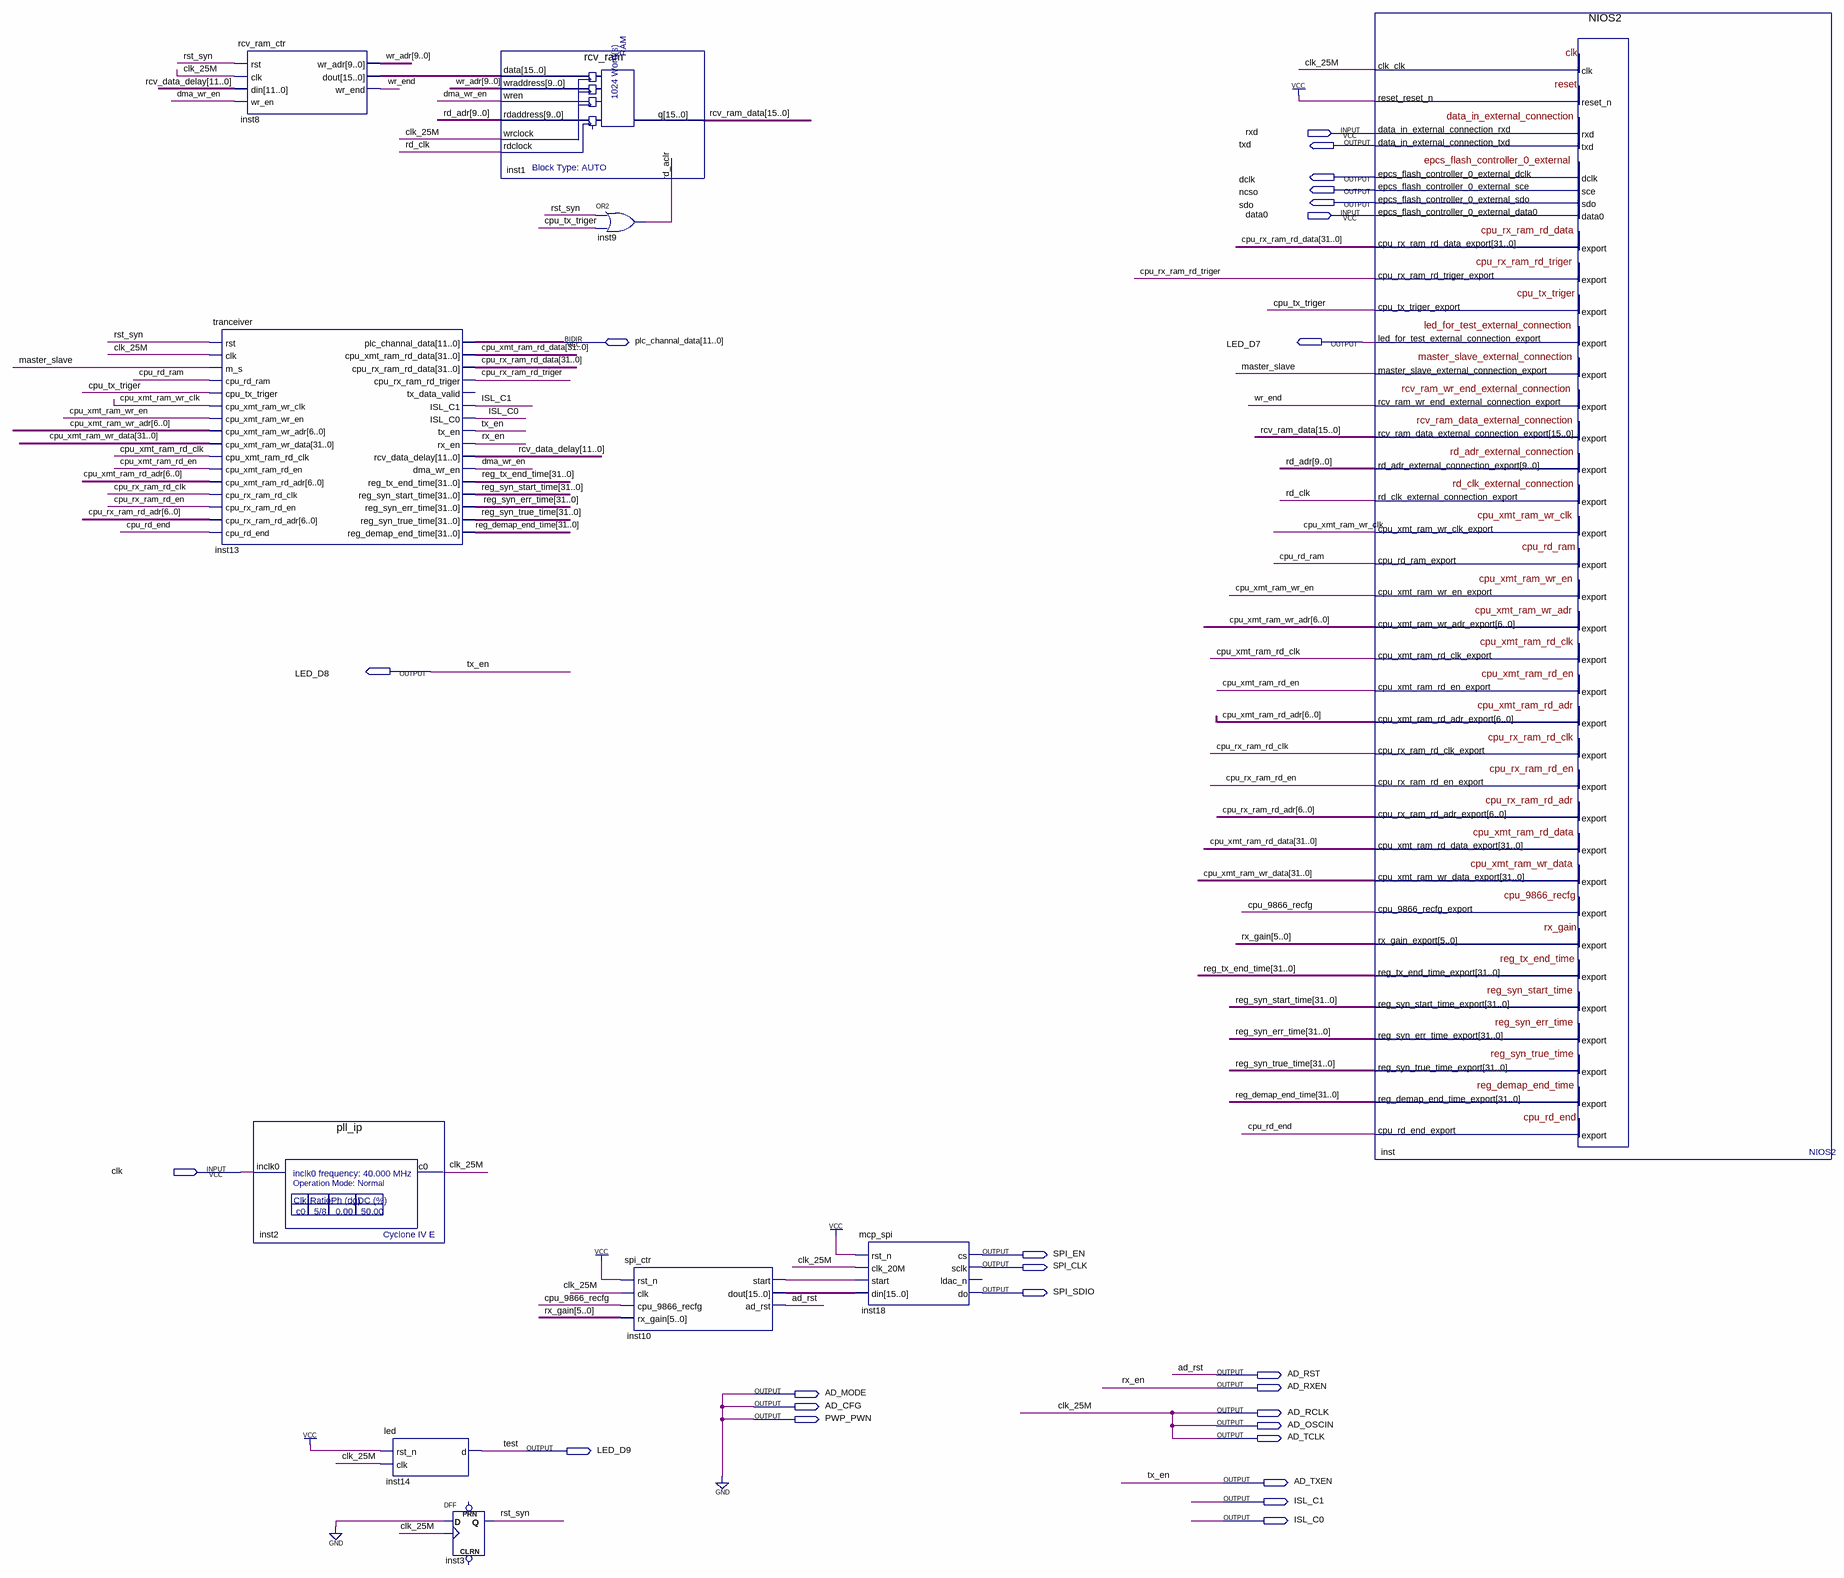
[diagram p0: schematic sheet]
// Quartus schematic plc_design_nios2.bdf as structural Verilog: 10 symbols, 25 pins
module plc_design_nios2 (
  input  rxd,
  input  data0,
  input  clk,
  inout  [11:0] plc_channal_data,
  output txd,
  output dclk,
  output ncso,
  output sdo,
  output LED_D7,
  output LED_D8,
  output SPI_EN,
  output SPI_CLK,
  output SPI_SDIO,
  output AD_RST,
  output AD_RXEN,
  output AD_MODE,
  output AD_CFG,
  output AD_RCLK,
  output PWP_PWN,
  output AD_OSCIN,
  output AD_TCLK,
  output LED_D9,
  output AD_TXEN,
  output ISL_C1,
  output ISL_C0
);

  wire cpu_9866_recfg, cpu_rd_end, cpu_rd_ram, cpu_rx_ram_rd_clk, cpu_rx_ram_rd_en, cpu_rx_ram_rd_triger,
       cpu_tx_triger, cpu_xmt_ram_rd_clk, cpu_xmt_ram_rd_en, cpu_xmt_ram_wr_clk, cpu_xmt_ram_wr_en,
       dma_wr_en, inst9_out, inst10_start, master_slave, rd_clk, rst_syn, wr_end;
  wire [5:0] rx_gain;
  wire [6:0] cpu_rx_ram_rd_adr, cpu_xmt_ram_rd_adr, cpu_xmt_ram_wr_adr;
  wire [9:0] rd_adr, wr_adr;
  wire [11:0] rcv_data_delay;
  wire [15:0] inst8_dout, inst10_dout, rcv_ram_data;
  wire [31:0] cpu_rx_ram_rd_data, cpu_xmt_ram_rd_data, cpu_xmt_ram_wr_data, reg_demap_end_time,
       reg_syn_err_time, reg_syn_start_time, reg_syn_true_time, reg_tx_end_time;

  rcv_ram_ctr inst8 (
    .rst(rst_syn), .clk(AD_OSCIN), .din(rcv_data_delay), .wr_en(dma_wr_en), .wr_adr(wr_adr),
    .dout(inst8_dout), .wr_end(wr_end));
  tranceiver inst13 (
    .rst(rst_syn), .clk(AD_OSCIN), .m_s(master_slave), .cpu_rd_ram(cpu_rd_ram),
    .cpu_tx_triger(cpu_tx_triger), .cpu_xmt_ram_wr_clk(cpu_xmt_ram_wr_clk),
    .cpu_xmt_ram_wr_en(cpu_xmt_ram_wr_en), .cpu_xmt_ram_wr_adr(cpu_xmt_ram_wr_adr),
    .cpu_xmt_ram_wr_data(cpu_xmt_ram_wr_data), .cpu_xmt_ram_rd_clk(cpu_xmt_ram_rd_clk),
    .cpu_xmt_ram_rd_en(cpu_xmt_ram_rd_en), .cpu_xmt_ram_rd_adr(cpu_xmt_ram_rd_adr),
    .cpu_rx_ram_rd_clk(cpu_rx_ram_rd_clk), .cpu_rx_ram_rd_en(cpu_rx_ram_rd_en),
    .cpu_rx_ram_rd_adr(cpu_rx_ram_rd_adr), .cpu_rd_end(cpu_rd_end),
    .cpu_xmt_ram_rd_data(cpu_xmt_ram_rd_data), .cpu_rx_ram_rd_data(cpu_rx_ram_rd_data),
    .cpu_rx_ram_rd_triger(cpu_rx_ram_rd_triger), .ISL_C1(ISL_C1), .ISL_C0(ISL_C0), .tx_en(AD_TXEN),
    .rx_en(AD_RXEN), .rcv_data_delay(rcv_data_delay), .dma_wr_en(dma_wr_en),
    .reg_tx_end_time(reg_tx_end_time), .reg_syn_start_time(reg_syn_start_time),
    .reg_syn_err_time(reg_syn_err_time), .reg_syn_true_time(reg_syn_true_time),
    .reg_demap_end_time(reg_demap_end_time), .plc_channal_data(plc_channal_data));  // open: tx_data_valid
  pll_ip inst2 (.inclk0(clk), .c0(AD_OSCIN));
  led inst14 (.rst_n(1'b1), .clk(AD_OSCIN), .d(LED_D9));
  DFF inst3 (.CLK(AD_OSCIN), .D(1'b0), .Q(rst_syn));  // open: CLRN, PRN
  rcv_ram inst1 (
    .data(inst8_dout), .wraddress(wr_adr), .wren(dma_wr_en), .rdaddress(rd_adr), .wrclock(AD_OSCIN),
    .rdclock(rd_clk), .rd_aclr(inst9_out), .q(rcv_ram_data));
  or inst9 (inst9_out, rst_syn, cpu_tx_triger);
  spi_ctr inst10 (
    .rst_n(1'b1), .clk(AD_OSCIN), .cpu_9866_recfg(cpu_9866_recfg), .rx_gain(rx_gain), .start(inst10_start),
    .dout(inst10_dout), .ad_rst(AD_RST));
  mcp_spi inst18 (
    .rst_n(1'b1), .clk_20M(AD_OSCIN), .start(inst10_start), .din(inst10_dout), .cs(SPI_EN), .sclk(SPI_CLK),
    .\do (SPI_SDIO));  // open: ldac_n
  NIOS2 inst (
    .clk_clk(AD_OSCIN), .reset_reset_n(1'b1), .data_in_external_connection_rxd(rxd),
    .epcs_flash_controller_0_external_data0(data0), .cpu_rx_ram_rd_data_export(cpu_rx_ram_rd_data),
    .cpu_rx_ram_rd_triger_export(cpu_rx_ram_rd_triger), .rcv_ram_wr_end_external_connection_export(wr_end),
    .rcv_ram_data_external_connection_export(rcv_ram_data), .cpu_xmt_ram_rd_data_export(cpu_xmt_ram_rd_data),
    .reg_tx_end_time_export(reg_tx_end_time), .reg_syn_start_time_export(reg_syn_start_time),
    .reg_syn_err_time_export(reg_syn_err_time), .reg_syn_true_time_export(reg_syn_true_time),
    .reg_demap_end_time_export(reg_demap_end_time), .data_in_external_connection_txd(txd),
    .epcs_flash_controller_0_external_dclk(dclk), .epcs_flash_controller_0_external_sce(ncso),
    .epcs_flash_controller_0_external_sdo(sdo), .cpu_tx_triger_export(cpu_tx_triger),
    .led_for_test_external_connection_export(LED_D7), .master_slave_external_connection_export(master_slave),
    .rd_adr_external_connection_export(rd_adr), .rd_clk_external_connection_export(rd_clk),
    .cpu_xmt_ram_wr_clk_export(cpu_xmt_ram_wr_clk), .cpu_rd_ram_export(cpu_rd_ram),
    .cpu_xmt_ram_wr_en_export(cpu_xmt_ram_wr_en), .cpu_xmt_ram_wr_adr_export(cpu_xmt_ram_wr_adr),
    .cpu_xmt_ram_rd_clk_export(cpu_xmt_ram_rd_clk), .cpu_xmt_ram_rd_en_export(cpu_xmt_ram_rd_en),
    .cpu_xmt_ram_rd_adr_export(cpu_xmt_ram_rd_adr), .cpu_rx_ram_rd_clk_export(cpu_rx_ram_rd_clk),
    .cpu_rx_ram_rd_en_export(cpu_rx_ram_rd_en), .cpu_rx_ram_rd_adr_export(cpu_rx_ram_rd_adr),
    .cpu_xmt_ram_wr_data_export(cpu_xmt_ram_wr_data), .cpu_9866_recfg_export(cpu_9866_recfg),
    .rx_gain_export(rx_gain), .cpu_rd_end_export(cpu_rd_end));

  assign AD_CFG = 1'b0;
  assign AD_MODE = 1'b0;
  assign AD_RCLK = AD_OSCIN;
  assign AD_TCLK = AD_OSCIN;
  assign LED_D8 = AD_TXEN;
  assign PWP_PWN = 1'b0;

  // Other names for the same wires on the sheet: clk_25M = AD_OSCIN; rx_en = AD_RXEN; test = LED_D9; tx_en = AD_TXEN
endmodule
